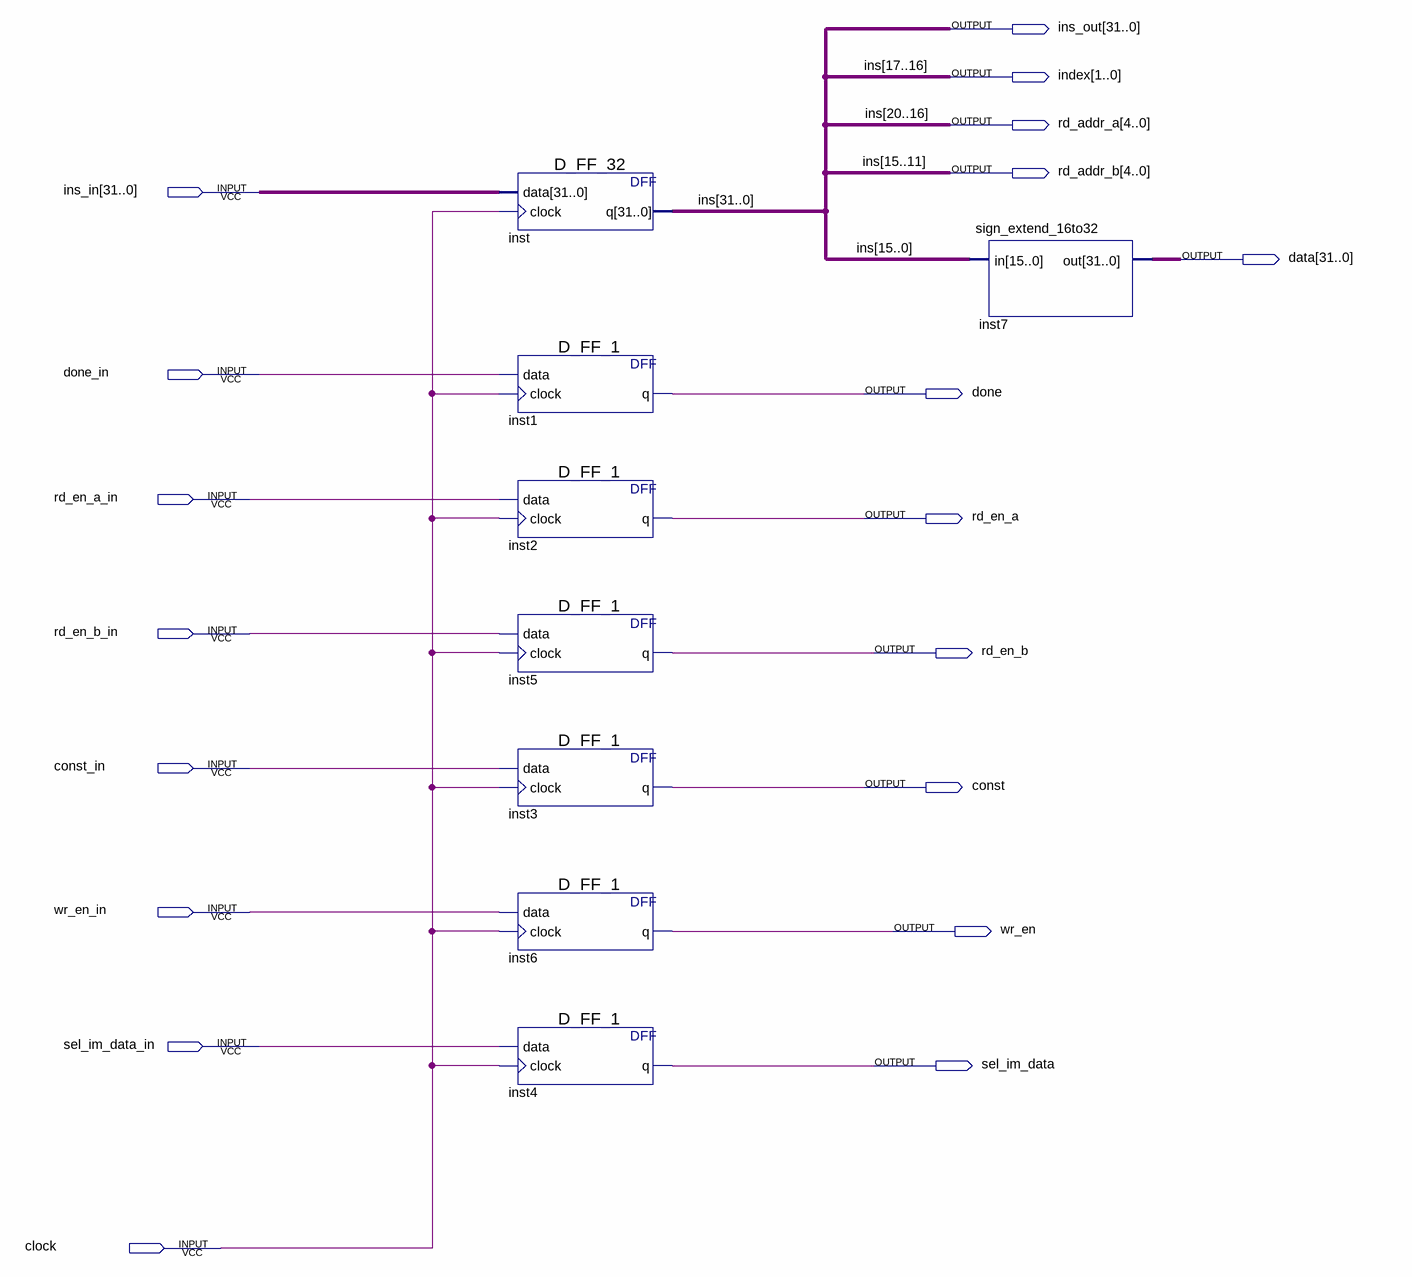
[diagram p0: schematic sheet]
// Quartus schematic CO_IF_ID.bdf as structural Verilog: 8 symbols, 19 pins
module CO_IF_ID (
  input  [31:0] ins_in,
  input  done_in,
  input  rd_en_a_in,
  input  rd_en_b_in,
  input  const_in,
  input  wr_en_in,
  input  sel_im_data_in,
  input  clock,
  output [31:0] ins_out,
  output [1:0] index,
  output [4:0] rd_addr_a,
  output [4:0] rd_addr_b,
  output [31:0] data,
  output done,
  output rd_en_a,
  output rd_en_b,
  output \const ,
  output wr_en,
  output sel_im_data
);

  D_FF_32 inst (.data(ins_in), .clock(clock), .q({ins_out[31:18], index, ins_out[15:0]}));
  D_FF_1 inst1 (.data(done_in), .clock(clock), .q(done));
  D_FF_1 inst2 (.data(rd_en_a_in), .clock(clock), .q(rd_en_a));
  D_FF_1 inst5 (.data(rd_en_b_in), .clock(clock), .q(rd_en_b));
  D_FF_1 inst3 (.data(const_in), .clock(clock), .q(\const ));
  D_FF_1 inst6 (.data(wr_en_in), .clock(clock), .q(wr_en));
  D_FF_1 inst4 (.data(sel_im_data_in), .clock(clock), .q(sel_im_data));
  sign_extend_16to32 inst7 (.in(ins_out[15:0]), .out(data));

  assign ins_out[17:16] = index;
  assign rd_addr_a = {ins_out[20:18], index};
  assign rd_addr_b = ins_out[15:11];

  // Other names for the same wires on the sheet: ins[31:0] = {ins_out[31:18], index, ins_out[15:0]}
endmodule
